# EAGLE design BMS Schematic (EAGLE 8.5.0)

## Sheet 1 of 3
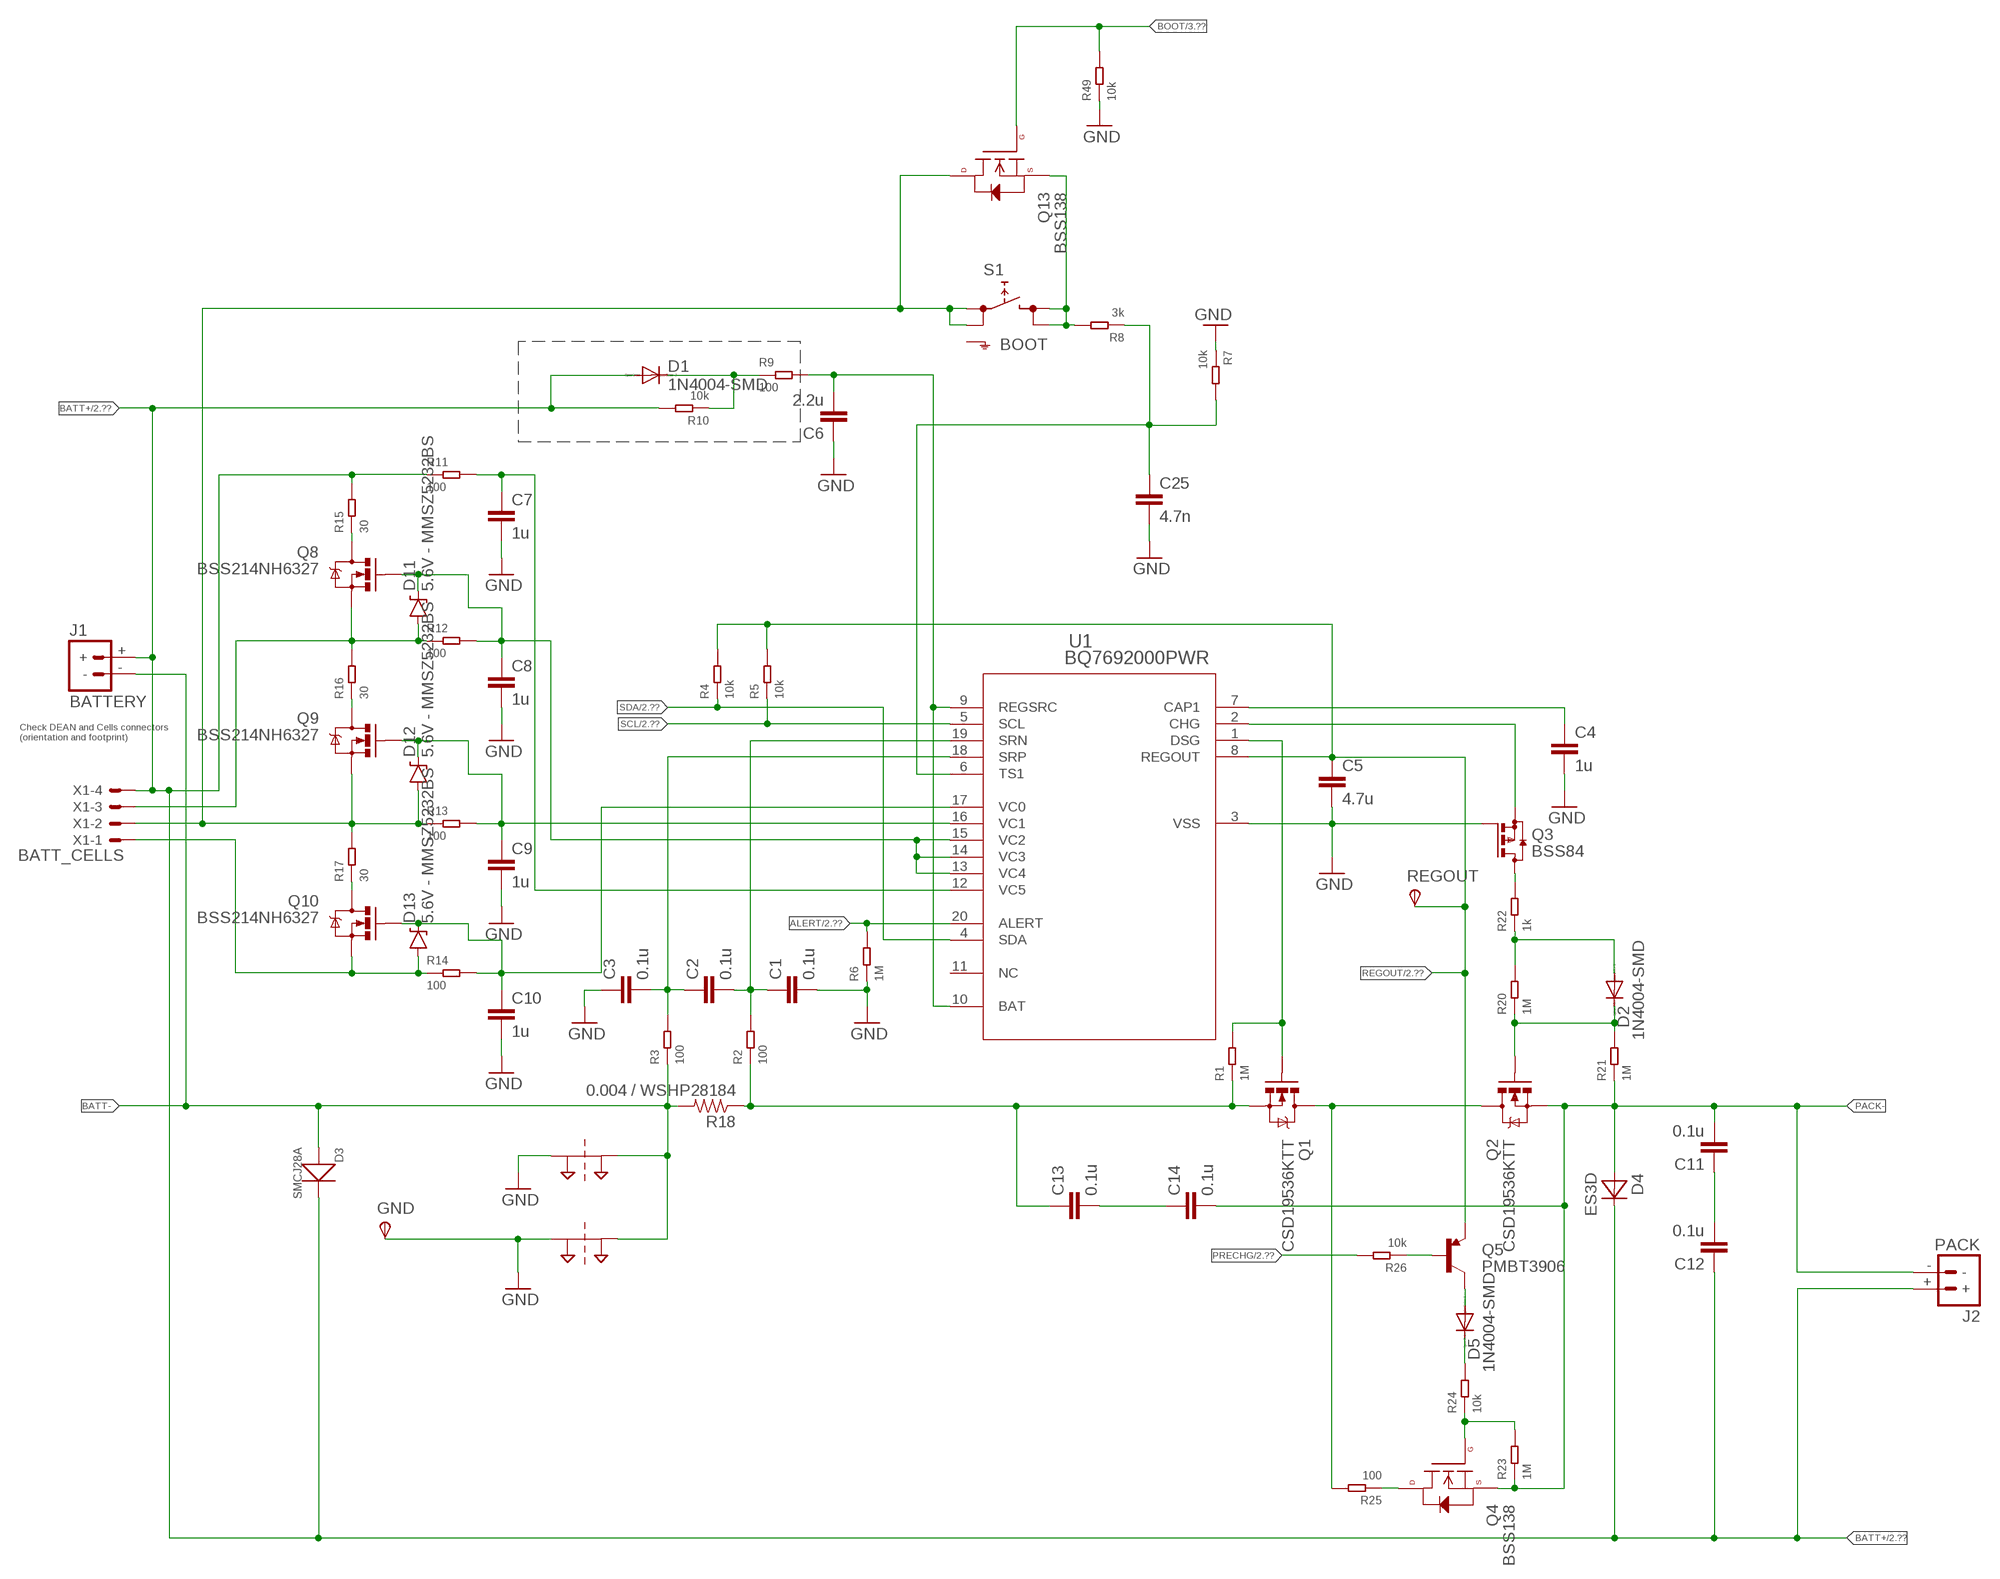
[diagram p0: schematic, sheet 1]

### Parts
C1  0.1u  CAP0805  [0805]
C2  0.1u  CAP0805  [0805]
C3  0.1u  CAP0805  [0805]
C4  1u  CAP0805  [0805]
C5  4.7u  CAP0805  [0805]
C6  2.2u  C-EUC1206  [C1206]
C7  1u  CAP0805  [0805]
C8  1u  CAP0805  [0805]
C9  1u  CAP0805  [0805]
C10  1u  CAP0805  [0805]
C11  0.1u  CAP0805  [0805]
C12  0.1u  CAP0805  [0805]
C13  0.1u  CAP0805  [0805]
C14  0.1u  CAP0805  [0805]
C25  4.7n  CAP0805  [0805]
D1  1N4004-SMD  [DO-214]
D2  1N4004-SMD  [DO-214]
D3  SMCJ28A  SMD-DIODE-SCHOTTKY-40V-3A(DO-214AB)  [DO-214AB]
D4  ES3D  [SMC]
D5  1N4004-SMD  [DO-214]
D11  5.6V - MMSZ5232BS  DIODE-ZENER5.6V  [SOD-323]
D12  5.6V - MMSZ5232BS  DIODE-ZENER5.6V  [SOD-323]
D13  5.6V - MMSZ5232BS  DIODE-ZENER5.6V  [SOD-323]
GND  GND  TPSPAD1-17  [P1-17]
J1  BATTERY  BATTERY_CONN_DEANS  [DEANS]
J2  PACK  BATTERY_CONN_DEANS  [DEANS]
PT1  2PT_GND_TIE  [2PT_GND_TIE]
PT2  2PT_GND_TIE  [2PT_GND_TIE]
Q1  CSD19536KTT  MOSFET-NCHANNELPSMN7R0  [TO-263/D2PAK]
Q2  CSD19536KTT  MOSFET-NCHANNELPSMN7R0  [TO-263/D2PAK]
Q3  BSS84  [SOT23]
Q4  BSS138  N-CHANNEL-MOSFET-BSS138  [SOT23-3]
Q5  PMBT3906  TRANSISTOR_PNPPMBT3906  [SOT23-3]
Q8  BSS214NH6327  MOSFET-NCHANNELBSS138  [SOT23-3]
Q9  BSS214NH6327  MOSFET-NCHANNELBSS138  [SOT23-3]
Q10  BSS214NH6327  MOSFET-NCHANNELBSS138  [SOT23-3]
Q13  BSS138  N-CHANNEL-MOSFET-BSS138  [SOT23-3]
R1  1M  RES-0805  [R0805]
R2  100  RES-0805  [R0805]
R3  100  RES-0805  [R0805]
R4  10k  RES-0805  [R0805]
R5  10k  RES-0805  [R0805]
R6  1M  RES-0805  [R0805]
R7  10k  RES-0805  [R0805]
R8  3k  RES-0805  [R0805]
R9  100  RES-0805  [R0805]
R10  10k  RES-0805  [R0805]
R11  100  RES-0805  [R0805]
R12  100  RES-0805  [R0805]
R13  100  RES-0805  [R0805]
R14  100  RES-0805  [R0805]
R15  30  RES-2512  [R2512]
R16  30  RES-2512  [R2512]
R17  30  RES-2512  [R2512]
R18  0.004 / WSHP28184  0.001OHM-3W-1%(2512)3W/1%  [2512]
R20  1M  RES-0805  [R0805]
R21  1M  RES-0805  [R0805]
R22  1k  RES-0805  [R0805]
R23  1M  RES-0805  [R0805]
R24  10k  RES-0805  [R0805]
R25  100  RES-2512  [R2512]
R26  10k  RES-0805  [R0805]
R49  10k  RES-0805  [R0805]
REGOUT  TPSB2,54  [B2,54]
S1  BOOT  SKHMPSE010  [SKHMPXE010]
U1  BQ7692000PWR  BQ7692006PWR  [PW20]
X1  BATT_CELLS  C-GRID-04-70543  [70543-04]

### Nets
ALERT: R6.2 U1.20(ALERT) ; also sheet 2
BATT+: C12.1 D1.A D3.2(-) D4.C J1.+ J2.+ R10.2 R11.1 R15.2 X1.4 ; also sheet 2,3
BATT-: D3.1(+) J1.- PT1.P$2 PT2.P$2 R3.1 R18.2
BOOT: Q13.1(G) R49.2 ; also sheet 3
CHG: Q3.2(S) U1.2(CHG)
DSG: Q1.1(G) R1.2 U1.1(DSG)
DSG-CHG: Q1.2(D) Q2.2(D) R25.2
GND: C1.2 C3.1 C4.2 C5.2 C6.1 C7.2 C8.2 C9.2 C10.2 C25.2 GND.TP(PP) PT1.P$1 PT2.P$1 Q3.1(G) R6.1 R7.1 R49.1 U1.3(VSS) ; also sheet 2,3
N$1: C2.1 C3.2 R3.2 U1.18(SRP)
N$2: C1.1 C2.2 R2.2 U1.19(SRN)
N$4: C6.2 R9.2 U1.9(REGSRC) U1.10(BAT)
N$5: C4.1 U1.7(CAP1)
N$9: C25.1 R7.2 R8.1 U1.6(TS1)
N$10: D1.C R9.1 R10.1
N$11: Q13.2(S) R8.2 S1.3(2.1) S1.4(2.2)
N$12: D13.A Q10.2(S) R14.1 X1.1
N$13: C7.1 R11.2 U1.12(VC5)
N$14: Q8.3(D) R15.1
N$16: C10.1 D13.C Q10.1(G) R14.2 U1.17(VC0)
N$18: D11.A Q8.2(S) R12.1 R16.2 X1.3
N$19: Q9.3(D) R16.1
N$20: D2.C Q2.1(G) R20.1 R21.2
N$21: C8.1 D11.C Q8.1(G) R12.2 U1.13(VC4) U1.14(VC3) U1.15(VC2)
N$22: Q10.3(D) R17.1
N$24: C11.1 C12.2
N$26: D2.A R20.2 R22.1
N$27: D12.A Q9.2(S) Q13.3(D) R13.1 R17.2 S1.1(1.1) S1.2(1.2) X1.2
N$28: Q3.3(D) R22.2
N$29: C13.2 C14.1
N$30: Q4.1(G) R23.2 R24.1
N$31: D5.C R24.2
N$32: D5.A Q5.3(C)
N$33: Q5.1(B) R26.1
N$34: Q4.3(D) R25.1
N$67: C9.1 D12.C Q9.1(G) R13.2 U1.16(VC1)
PACK-: C11.2 C14.2 D4.A J2.- Q2.3(S) Q4.2(S) R21.1 R23.1
PRECHG: R26.2 ; also sheet 2
REGOUT: C5.1 Q5.2(E) R4.2 R5.2 REGOUT.TP(PP) U1.8(REGOUT) ; also sheet 2,3
RSNS-DSG: C13.1 Q1.3(S) R1.1 R2.1 R18.1
SCL: R5.1 U1.5(SCL) ; also sheet 2
SDA: R4.1 U1.4(SDA) ; also sheet 2
Unconnected: S1.5(SH) U1.11(NC)

### Notes on the sheet
- Check DEAN and Cells connectors 
  (orientation and footprint)

## Sheet 2 of 3
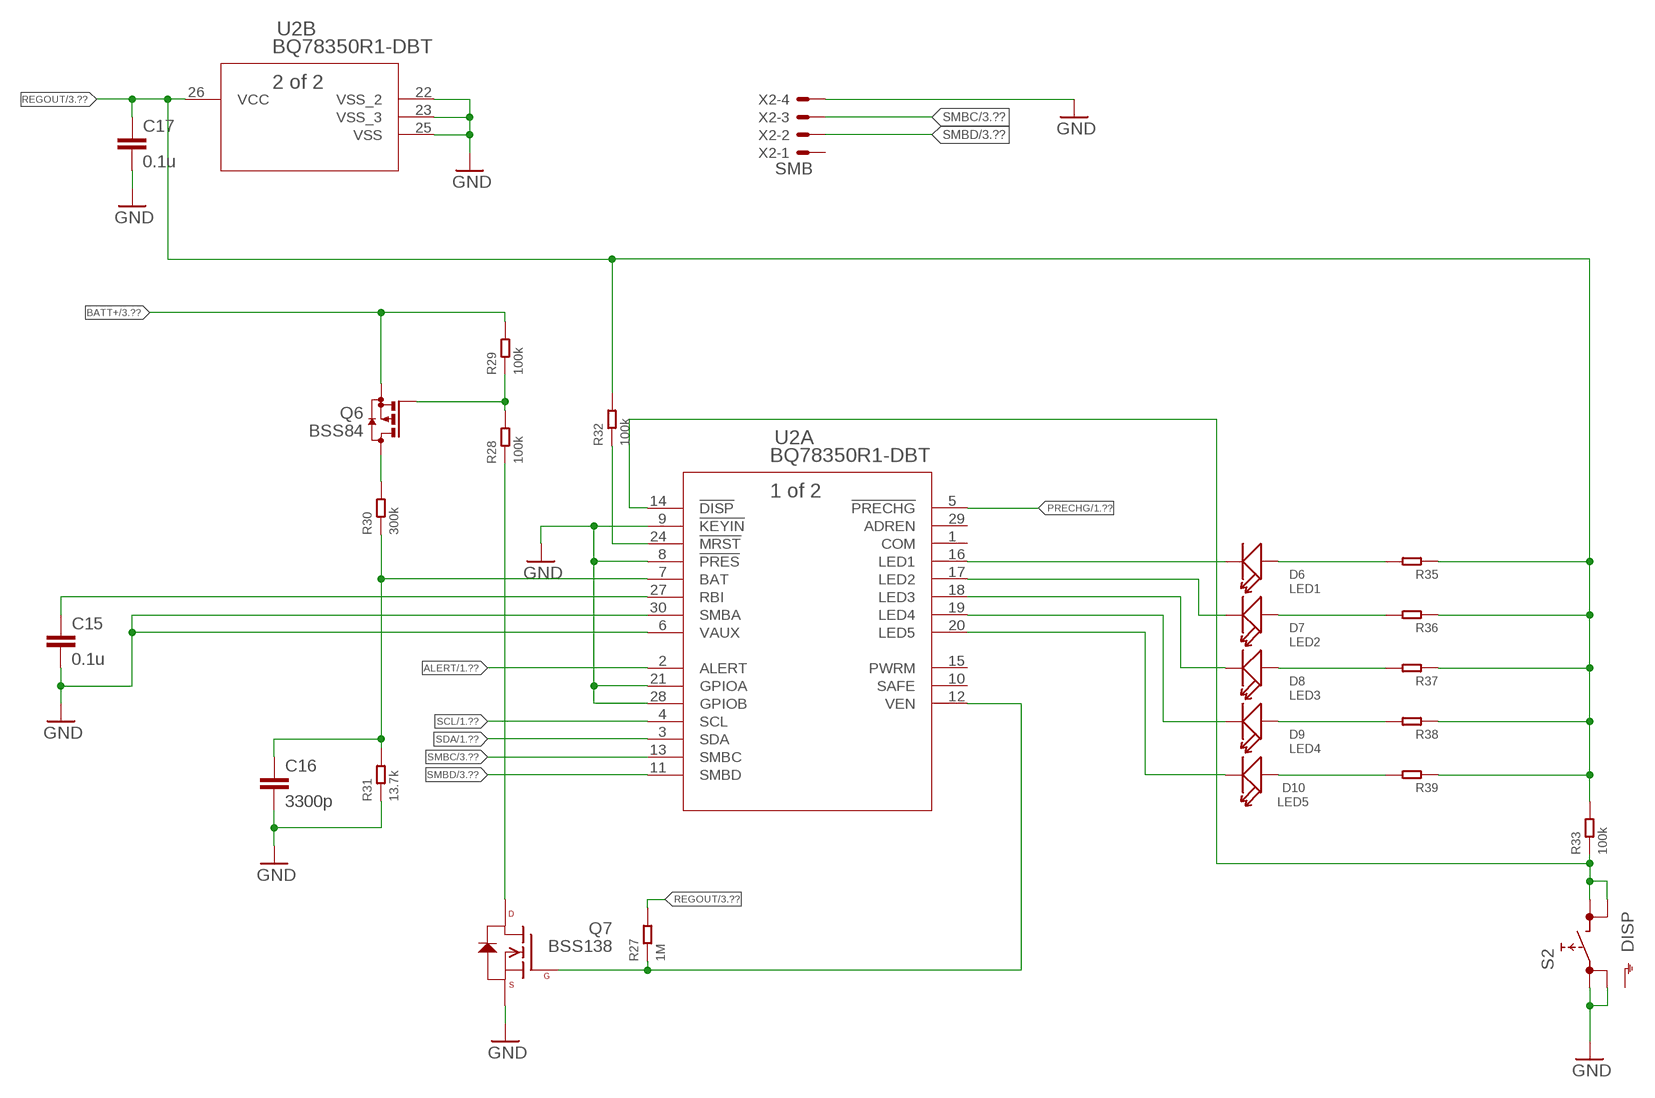
[diagram p1: schematic, sheet 2]

### Parts
C15  0.1u  CAP0805  [0805]
C16  3300p  CAP0805  [0805]
C17  0.1u  CAP0805  [0805]
D6  LED1  SMD-LED-CLEAR-GREEN(0805)  [LED-0805]
D7  LED2  SMD-LED-CLEAR-GREEN(0805)  [LED-0805]
D8  LED3  SMD-LED-CLEAR-GREEN(0805)  [LED-0805]
D9  LED4  SMD-LED-CLEAR-GREEN(0805)  [LED-0805]
D10  LED5  SMD-LED-CLEAR-RED(0805)  [LED-0805]
Q6  BSS84  [SOT23]
Q7  BSS138  N-CHANNEL-MOSFET-BSS138  [SOT23-3]
R27  1M  RES-0805  [R0805]
R28  100k  RES-0805  [R0805]
R29  100k  RES-0805  [R0805]
R30  300k  RES-0805  [R0805]
R31  13.7k  RES-0805  [R0805]
R32  100k  RES-0805  [R0805]
R33  100k  RES-0805  [R0805]
R35  RES-0805  [R0805]
R36  RES-0805  [R0805]
R37  RES-0805  [R0805]
R38  RES-0805  [R0805]
R39  RES-0805  [R0805]
S2  DISP  SKHMPSE010  [SKHMPXE010]
U2  BQ78350R1-DBT  [DBT30]
X2  SMB  C-GRID-04-70543  [70543-04]

### Nets
ALERT: U2.2(A:ALERT) ; also sheet 1
BATT+: Q6.2(S) R29.2 ; also sheet 1,3
GND: C15.2 C16.2 C17.2 Q7.2(S) R31.1 S2.1(1.1) S2.2(1.2) U2.6(A:VAUX) U2.8(A:!PRES) U2.9(A:!KEYIN) U2.21(A:GPIOA) U2.22(B:VSS_2) U2.23(B:VSS_3) U2.25(B:VSS) U2.28(A:GPIOB) U2.30(A:SMBA) X2.4 ; also sheet 1,3
N$23: C15.1 U2.27(A:RBI)
N$35: Q7.1(G) R27.1 U2.12(A:VEN)
N$36: Q7.3(D) R28.1
N$37: Q6.1(G) R28.2 R29.1
N$38: Q6.3(D) R30.2
N$39: C16.1 R30.1 R31.2 U2.7(A:BAT)
N$40: R32.1 U2.24(A:!MRST)
N$41: D6.- U2.16(A:LED1)
N$42: D7.- U2.17(A:LED2)
N$43: D8.- U2.18(A:LED3)
N$44: D9.- U2.19(A:LED4)
N$45: D10.- U2.20(A:LED5)
N$46: D6.+ R35.2
N$47: D7.+ R36.2
N$48: R33.1 S2.3(2.1) S2.4(2.2) U2.14(A:!DISP)
N$49: D8.+ R37.2
N$50: D9.+ R38.2
N$51: D10.+ R39.2
PRECHG: U2.5(A:!PRECHG) ; also sheet 1
REGOUT: C17.1 R27.2 R32.2 R33.2 R35.1 R36.1 R37.1 R38.1 R39.1 U2.26(B:VCC) ; also sheet 1,3
SCL: U2.4(A:SCL) ; also sheet 1
SDA: U2.3(A:SDA) ; also sheet 1
SMBC: U2.13(A:SMBC) X2.3 ; also sheet 3
SMBD: U2.11(A:SMBD) X2.2 ; also sheet 3
Unconnected: S2.5(SH) U2.1(A:COM) U2.10(A:SAFE) U2.15(A:PWRM) U2.29(A:ADREN) X2.1

## Sheet 3 of 3
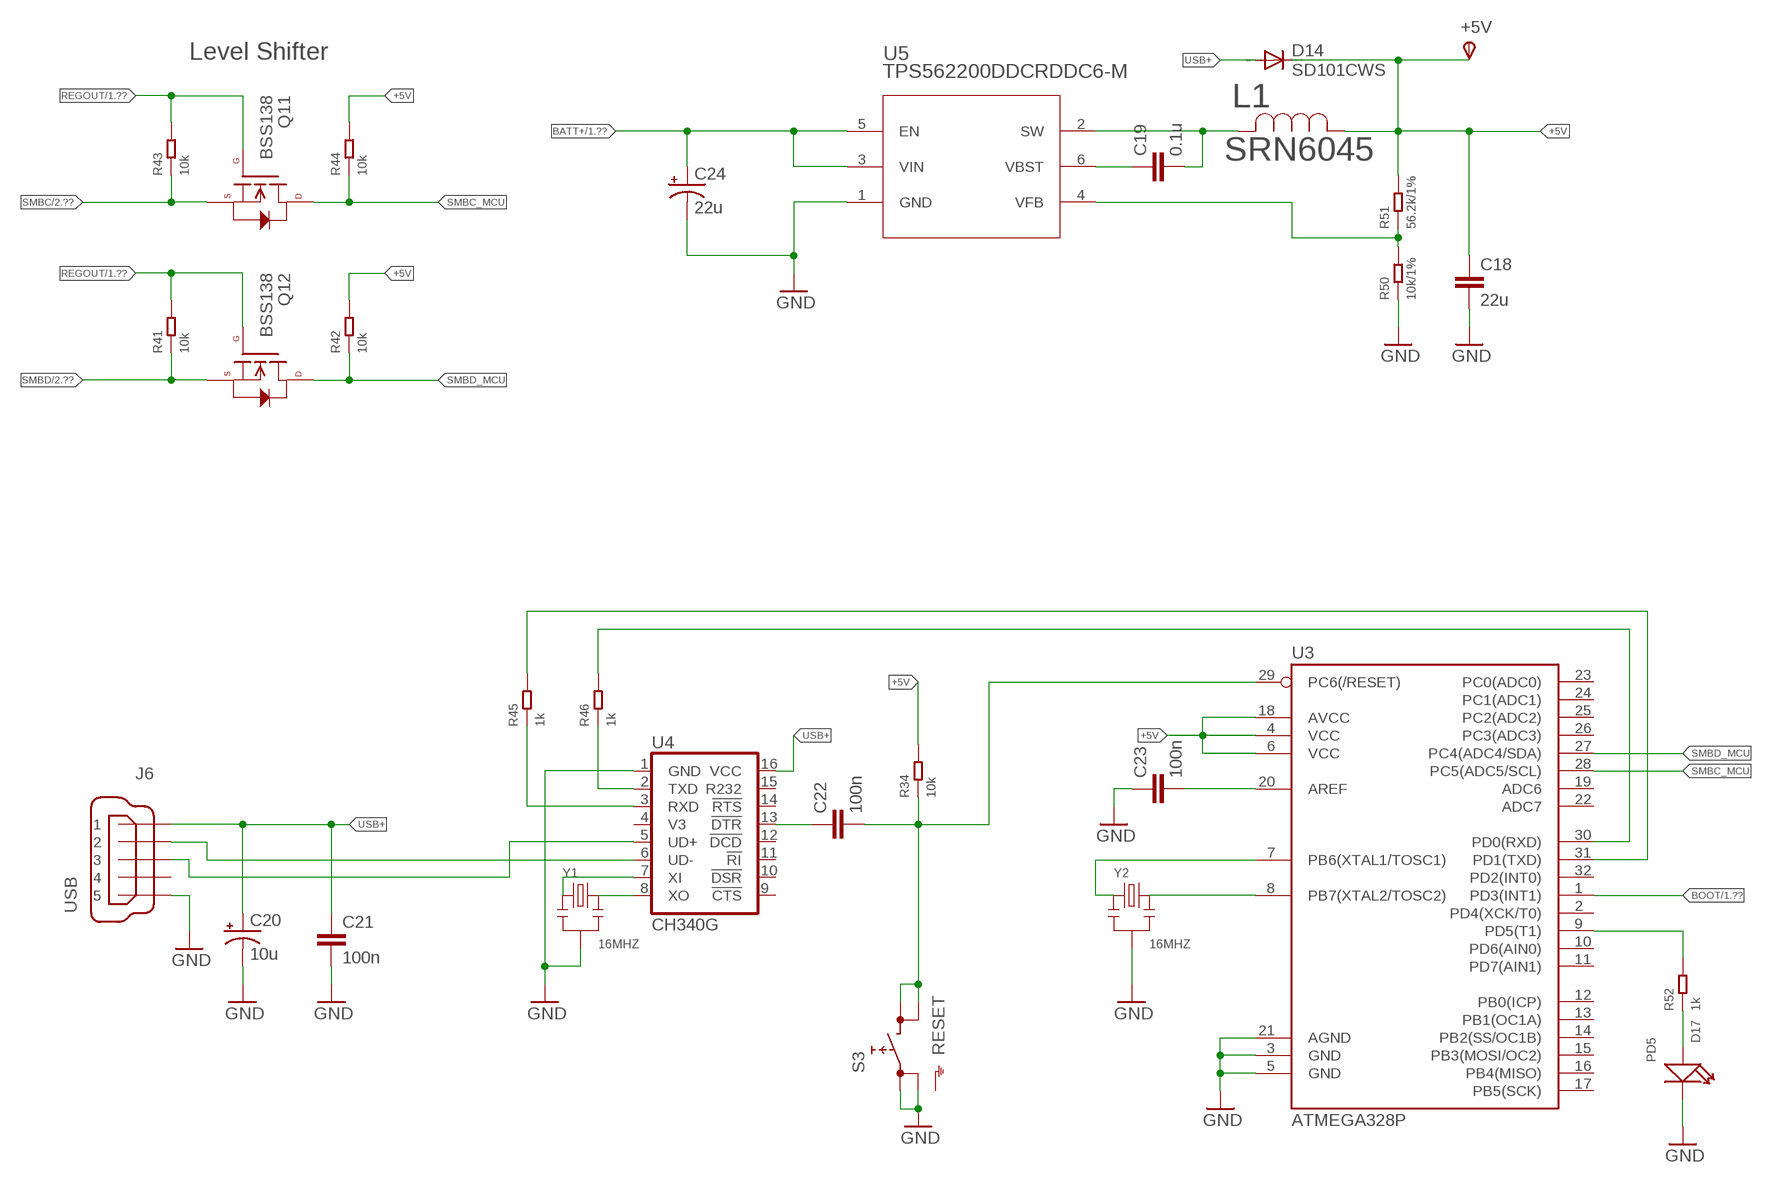
[diagram p2: schematic, sheet 3]

### Parts
+5V  TPSB2,54  [B2,54]
C18  22u  CAP0805  [0805]
C19  0.1u  CAP0805  [0805]
C20  10u  CAP_POL1206-KIT  [EIA3216-KIT]
C21  100n  CAP0603-CAP  [0603-CAP]
C22  100n  CAP0603-CAP  [0603-CAP]
C23  100n  CAP0603-CAP  [0603-CAP]
C24  22u  CAP_POLC  [PANASONIC_C]
D14  SD101CWS  DIODE-SOD323-W  [SOD323-W]
D17  PD5  SMD-LED-CLEAR-GREEN(0805)  [LED-0805]
J6  USB  MINI-USB-ARDUINO-NANO  [USB-MINI-B_2]
L1  SRN6045  BOURNS_SRN6045  [IND_BOURNS_SRN6045]
Q11  BSS138  N-CHANNEL-MOSFET-BSS138  [SOT23-3]
Q12  BSS138  N-CHANNEL-MOSFET-BSS138  [SOT23-3]
R34  10k  RES-0805  [R0805]
R41  10k  RES-0805  [R0805]
R42  10k  RES-0805  [R0805]
R43  10k  RES-0805  [R0805]
R44  10k  RES-0805  [R0805]
R45  1k  RES-0805  [R0805]
R46  1k  RES-0805  [R0805]
R50  10k/1%  RES-0805  [R0805]
R51  56.2k/1%  RES-0805  [R0805]
R52  1k  RES-0805  [R0805]
S3  RESET  SKHMPSE010  [SKHMPXE010]
U3  ATMEGA328P  ATMEGA328P_TQFP  [TQFP32-08]
U4  CH340G  CH340GSMD  [SO016]
U5  TPS562200DDCRDDC6-M  [DDC6-M]
Y1  16MHZ  SMD-RESONATOR-16MHZ-15PF-0.5%-40R(3P-3.2X1.3MM)  [X3-SMD-3.6X1.3X0.8MM]
Y2  16MHZ  SMD-RESONATOR-16MHZ-15PF-0.5%-40R(3P-3.2X1.3MM)  [X3-SMD-3.6X1.3X0.8MM]

### Nets
+5V: +5V.TP(PP) C18.1 D14.C L1.1 R34.2 R42.2 R44.2 R51.2 U3.4(VCC) U3.6(VCC) U3.18(AVCC)
BATT+: C24.+ U5.3(VIN) U5.5(EN) ; also sheet 1,2
BOOT: U3.1(PD3(INT1)) ; also sheet 1
GND: C18.2 C20.C(-) C21.2 C23.1 C24.- D17.- J6.1 R50.1 S3.1(1.1) S3.2(1.2) U3.3(GND) U3.5(GND) U3.21(AGND) U4.1(GND) U5.1(GND) Y1.2 Y2.2 ; also sheet 1,2
N$6: J6.4 U4.6(UD-)
N$7: J6.3 U4.5(UD+)
N$55: C22.1 U4.13(!DTR)
N$56: C22.2 R34.1 S3.3(2.1) S3.4(2.2) U3.29(PC6(/RESET))
N$58: U4.7(XI) Y1.1
N$59: U4.8(XO) Y1.3
N$60: R45.1 U4.3(RXD)
N$61: U3.8(PB7(XTAL2/TOSC2)) Y2.3
N$62: U3.7(PB6(XTAL1/TOSC1)) Y2.1
N$63: R46.1 U4.2(TXD)
N$64: R45.2 U3.31(PD1(TXD))
N$65: R46.2 U3.30(PD0(RXD))
N$66: C23.2 U3.20(AREF)
N$68: R50.2 R51.1 U5.4(VFB)
N$70: C19.1 U5.6(VBST)
N$71: R52.2 U3.9(PD5(T1))
N$72: D17.+ R52.1
REGOUT: Q11.1(G) Q12.1(G) R41.2 R43.2 ; also sheet 1,2
SMBC: Q11.2(S) R43.1 ; also sheet 2
SMBC_MCU: Q11.3(D) R44.1 U3.28(PC5(ADC5/SCL))
SMBD: Q12.2(S) R41.1 ; also sheet 2
SMBD_MCU: Q12.3(D) R42.1 U3.27(PC4(ADC4/SDA))
SW: C19.2 L1.2 U5.2(SW)
USB+: C20.A(+) C21.1 D14.A J6.5 U4.16(VCC)
Unconnected: J6.2 S3.5(SH) U3.2(PD4(XCK/T0)) U3.10(PD6(AIN0)) U3.11(PD7(AIN1)) U3.12(PB0(ICP)) U3.13(PB1(OC1A)) U3.14(PB2(SS/OC1B)) U3.15(PB3(MOSI/OC2)) U3.16(PB4(MISO)) U3.17(PB5(SCK)) U3.19(ADC6) U3.22(ADC7) U3.23(PC0(ADC0)) U3.24(PC1(ADC1)) U3.25(PC2(ADC2)) U3.26(PC3(ADC3)) U3.32(PD2(INT0)) U4.4(V3) U4.9(!CTS) U4.10(!DSR) U4.11(!RI) U4.12(!DCD) U4.14(!RTS) U4.15(R232)

### Notes on the sheet
- Level Shifter

## Library data of the parts
+5V REGOUT = testpad:TPS: TEST PIN
C1-C5 C7-C19 C21-C23 C25 = SparkFun-Passives:CAP: Capacitor Standard 0603 ceramic capacitor, and 0.1" leaded capacitor.
C6 = resistor:C-EU: CAPACITOR, European symbol
C20 C24 = SparkFun-Capacitors:CAP_POL: Capacitor Polarized These are standard SMD and PTH capacitors. Normally 10uF, 47uF, and 100uF in electrolytic and tantalum varieties. Always verify the external diameter of the through hole cap, it varies with capacity, voltage, and manufacturer. The EIA devices should be standard.
D1 D2 D5 = 0_Club_robot:1N4004: DIODE general purpose rectifier, 1 A
D3 = Seeed-OPL-Diode:SMD-DIODE-SCHOTTKY-40V-3A(DO-214AB): 304020018; MPN: SS34-E3/57T; VALUE: 40V-3A
D4 = 0_Club_robot:ES3D: Rectifier diode 3A 200V
D6-D9 D17 = Seeed-OPL-Diode:SMD-LED-CLEAR-GREEN(0805): 304090057; MPN: 17-215SYGC/S530-E2/TR8; VALUE: GREEN-0805
D10 = Seeed-OPL-Diode:SMD-LED-CLEAR-RED(0805): 304090046; MPN: 17-215SURC/S530-A2/TR8; VALUE: RED-0805
D11-D13 = SparkFun-DiscreteSemi:DIODE-ZENER: Zener Diode Production Part - 8199 3.4V Zener Voltage; PROD_ID: DIO-12442; VALUE: 5.6V
D14 = diode:DIODE-: DIODE
GND = testpad:TPS: TEST PIN; SPICEPREFIX: X
J1 J2 = SparkFun-Connectors-Save:BATTERY_CONN: Battery Connectors Various footprints for battery connections SparkFun Products: Deans Connector -M/F Pair <https://www.sparkfun.com/products/11864>; SF_ID: PRT-11864
J6 = MyCON2:MINI-USB-ARDUINO-NANO
L1 = inductanceBuck:BOURNS_SRN6045
PT1 PT2 = SparkFun-Passives:2PT_GND_TIE: Package for connecting two ground nets in one place.
Q1 Q2 = SparkFun-DiscreteSemi:MOSFET-NCHANNEL: Common NMOSFET Parts MFG P/N Store ID Prod ID FDD8780 TRANS-09984 SI7820DN TRANS-11055 FDS6630A IC-08089 2N7002PW TRANS-11151 FQP30N06L COM-10213 TRANS-10060 BSS123LT1G TRANS-08345 BSS138 TRANS-00830 BS170 2N7000; PROD_ID: TRANS-12437; VALUE: 100A/100V
Q3 Q6 = transistor-small-signal:BSS84: P-CHANNEL MOS FET
Q4 Q7 Q11-Q13 = GeekAmmo:N-CHANNEL-MOSFET: N-Channel MOSFET Mode Field Effect Transistor; DATASHEET: http://www.fairchildsemi.com/ds/BS/BSS138.pdf; DIGIKEY: BSS138TR-ND; ELEMENT14: 2323154; URL: http://au.element14.com/fairchild-semiconductor/bss138/mosfet-n-ch-50v-220ma-sot-23/dp/2323154
Q5 = SparkFun-DiscreteSemi:TRANSISTOR_PNP: Generic PNP BJT Double check pinouts against datasheets- not all devices are the same! MMBT3906 - 40V 200mA SOT-23 (TRANS-08052) MMBT4403 - 40V 600mA SOT-23 (TRANS-09245); PROD_ID: TRANS-08052
Q8-Q10 = SparkFun-DiscreteSemi:MOSFET-NCHANNEL: Common NMOSFET Parts MFG P/N Store ID Prod ID FDD8780 TRANS-09984 SI7820DN TRANS-11055 FDS6630A IC-08089 2N7002PW TRANS-11151 FQP30N06L COM-10213 TRANS-10060 BSS123LT1G TRANS-08345 BSS138 TRANS-00830 BS170 2N7000; PROD_ID: TRANS-00830; VALUE: 200mA/50V
R1-R17 R20-R39 R41-R46 R49-R52 = Seeed-OPL-Resistor:RES
R18 = SparkFun-Resistors:0.001OHM-3W-1%(2512); PROD_ID: RES-12449; VALUE: 0.001
S1-S3 = switch:SKHMP*E010: 6.2 X 6.5mm TACT Switch (SMD) Source: http://www3.alps.co.jp/WebObjects/catalog.woa/PDF/E/Switch/Tact/SKHM/SKHM.PDF
U1 = BQ76920:BQ7692006PWR; MANUFACTURER_PART_NUMBER: BQ7692006PWR; VENDOR: Texas Instruments
U2 = bq78350:BQ78350R1-DBT; MANUFACTURER_PART_NUMBER: BQ78350DBT; VENDOR: Texas Instruments
U3 = SparkFun-DigitalIC:ATMEGA328P_TQFP; PROD_ID: IC-09069; VALUE: ATMEGA328P_TQFP
U4 = Serial-Basic:CH340G: A simple USB 2.0 to Serial IC.; PROD_ID: IC-13498
U5 = TPS562200:TPS562200DDCR; MANUFACTURER_PART_NUMBER: TPS562200DDCR; VENDOR: Texas Instruments
X1 X2 = con-molex:C-GRID-04: CONNECTOR wire to board 2.54 mm (0.100") pitch header; OC_FARNELL: unknown; OC_NEWARK: unknown
Y1 Y2 = Seeed-OPL-Crystal-Oscillator:SMD-RESONATOR-16MHZ-15PF-0.5%-40R(3P-3.2X1.3MM): 306030002; MPN: CSTCE16M0V53-R0

## Board
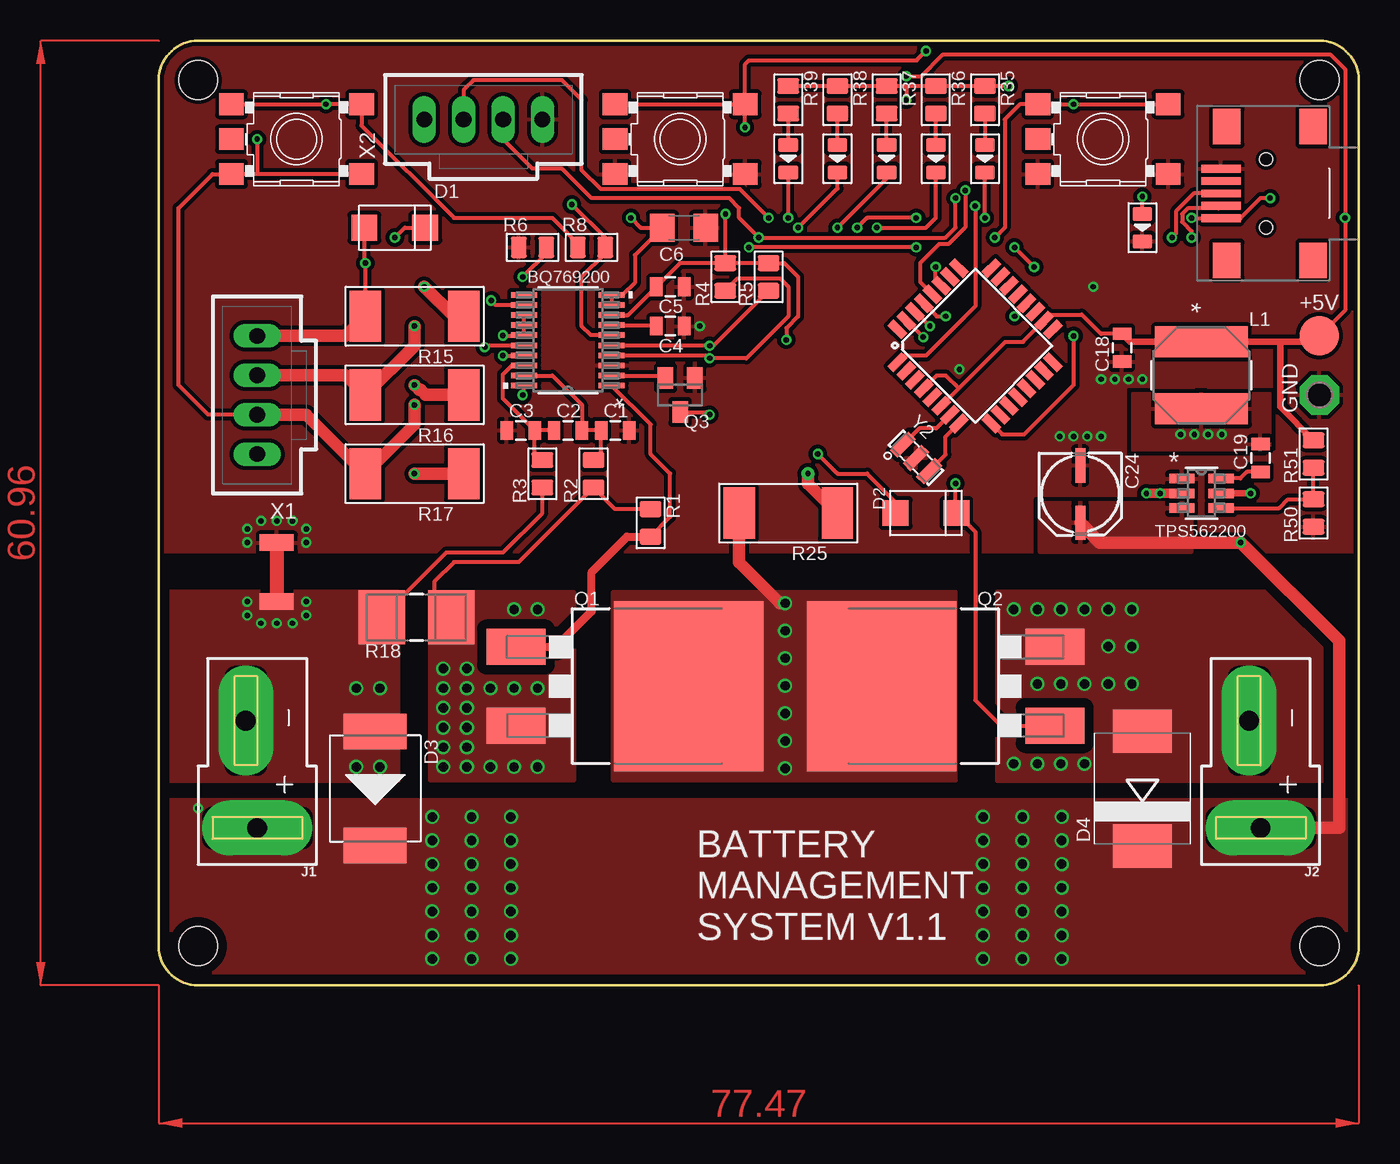
[diagram p3: board, top side]
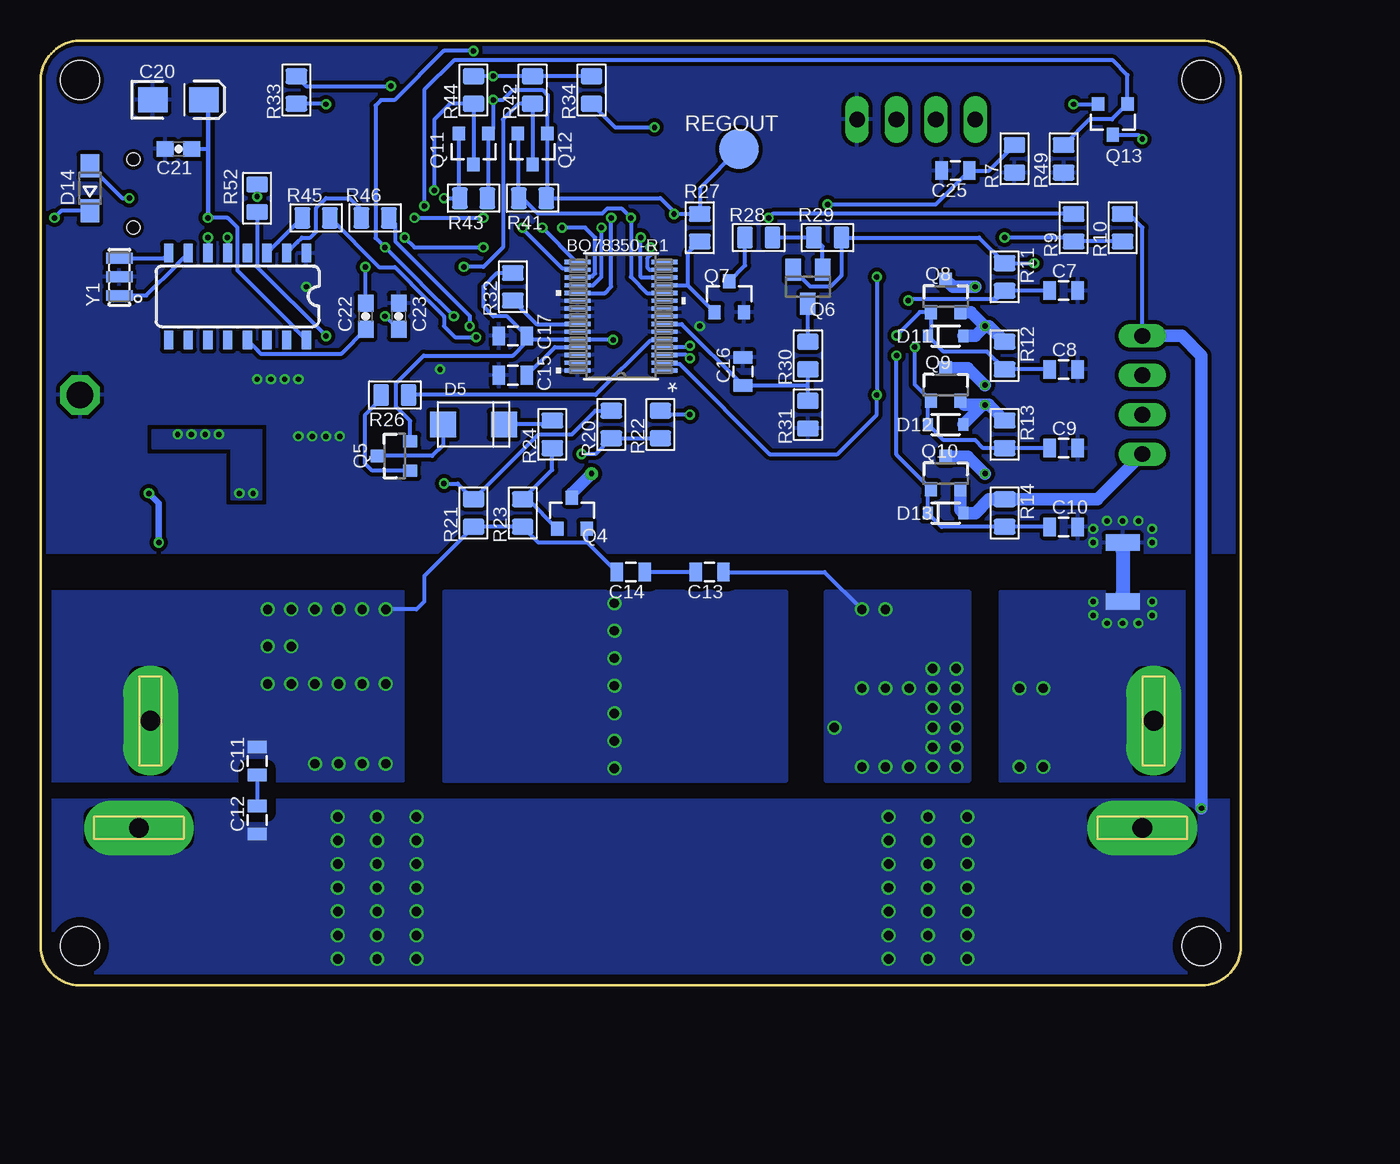
[diagram p4: board, bottom side, seen from below]

Size 77.47 x 60.96 mm. Coordinates in mm from the lower left corner, seen from the top.
Outline: 2.54,0 arc-90 0,2.54 0,58.42 arc-90 2.54,60.96 74.93,60.96 arc-90 77.47,58.42 77.47,2.54 arc-90 74.93,0 2.54,0
Copper layers (1*16): Top 0.035mm / dielectric 1.5mm / Bottom 0.035mm
Design rules "SeeedStudio_2layer_DRU_no_angle_20140221": minimum track width 6mil, minimum drill 12mil, track to track 6mil, track to pad 6mil, pad to pad 6mil, via to via 6mil, smd to smd 0mil, copper to edge 10mil, drill to drill 10mil, minimum pad ring 10mil, minimum via ring 6mil, stop-mask expansion 2mil, vias tented up to drill 100mil, thermal gap 10mil
Holes 2.5 mm at 2.54,2.54 2.54,58.42 74.93,2.54 74.93,58.42

### Footprints (pad centres in the part's own frame; a part is rotated, then mirrored left to right if it is on the bottom)
B2,54 = smd 2.54 x 2.54: TP 0,0
0805 = smd 0.8 x 1.2: 1 -0.9,0; 2 0.9,0
C1206 = smd 1.6 x 1.8: 1 -1.4,0; 2 1.4,0
EIA3216-KIT = smd 1.9 x 1.6: A 1.65,0; C -1.65,0
0603-CAP = smd 1.1 x 1: 1 -0.85,0; 2 0.85,0
PANASONIC_C = smd 2.2 x 0.65: + 1.9,-0.2; - -1.8,-0.2
DO-214 = smd 1.67 x 1.67: A -1.965,0; C 1.965,0
DO-214AB = smd 2.286 x 4.064: 1 -3.683,0; 2 3.683,0
SMC = smd 2.8 x 3.8: A 3.7,0; C -3.7,0
LED-0805 = smd 0.889 x 1.27: + -0.889,0; - 0.889,0
SOD-323 = smd 0.63 x 0.83: A 1.15,0; C -1.15,0
SOD323-W = smd 1.5 x 1.2: A 1.45,0; C -1.45,0
P1-17 = drill 1.702 pad 2.54 octagon: TP 0,0
DEANS = drill 1.27 pad 3.556 long: + 0,0; - 0.737,-6.921
USB-MINI-B_2 = smd 0.508 x 2.54: 1 0,0; 2 0.8,0; 3 1.6,0; 4 2.4,0; 5 3.2,0 | smd 2.286 x 1.778: 6 -2.717,5.948; 7 -2.717,0.36; 8 5.918,0.36; 9 5.918,5.948 | hole 0.813: -0.6,2.9; 3.8,2.9
IND_BOURNS_SRN6045 = smd 2.007 x 5.994: 1 -2.159,0; 2 2.159,0
2PT_GND_TIE = smd 2.184 x 1.067: P$1 0,1.905; P$2 0,-1.905
TO-263/D2PAK = smd 2.32 x 3.81: 1 -2.54,-7.045; 3 2.54,-7.045 | smd 11 x 9.65: 2 0,4.125
SOT23 = smd 1 x 1.4: 1 -0.95,-1.1; 2 0.95,-1.1; 3 0,1.1
SOT23-3 = smd 0.8 x 0.9: 1 -0.95,-1; 2 0.95,-1; 3 0,1
SOT23-3' = smd 0.8 x 0.9: 1 -0.95,-1; 2 0.95,-1; 3 0,1.1
R0805 = smd 1.397 x 1.016: 1 0,0.889; 2 0,-0.889
R2512 = smd 2.032 x 3.302: 1 -3.175,0; 2 3.175,0
2512 = smd 3 x 3.5: 1 -2.25,0; 2 2.25,0
SKHMPXE010 = smd 1.6 x 1.4: 1 -4.2,2.25; 2 4.2,2.25; 3 -4.2,-2.25; 4 4.2,-2.25; 5 4.2,0
PW20 = smd 1.676 x 0.356: 1 -2.819,2.925; 2 -2.819,2.275; 3 -2.819,1.625; 4 -2.819,0.975; 5 -2.819,0.325; 6 -2.819,-0.325; 7 -2.819,-0.975; 8 -2.819,-1.625; 9 -2.819,-2.275; 10 -2.819,-2.925; 11 2.819,-2.925; 12 2.819,-2.275; 13 2.819,-1.625; 14 2.819,-0.975; 15 2.819,-0.325; 16 2.819,0.325; 17 2.819,0.975; 18 2.819,1.625; 19 2.819,2.275; 20 2.819,2.925
DBT30 = smd 1.676 x 0.279: 1 -2.819,3.5; 2 -2.819,3; 3 -2.819,2.5; 4 -2.819,2; 5 -2.819,1.5; 6 -2.819,1; 7 -2.819,0.5; 8 -2.819,0; 9 -2.819,-0.5; 10 -2.819,-1; 11 -2.819,-1.5; 12 -2.819,-2; 13 -2.819,-2.5; 14 -2.819,-3; 15 -2.819,-3.5; 16 2.819,-3.5; 17 2.819,-3; 18 2.819,-2.5; 19 2.819,-2; 20 2.819,-1.5; 21 2.819,-1; 22 2.819,-0.5; 23 2.819,0; 24 2.819,0.5; 25 2.819,1; 26 2.819,1.5; 27 2.819,2; 28 2.819,2.5; 29 2.819,3; 30 2.819,3.5
TQFP32-08 = smd 1.27 x 0.559: 1 -4.293,2.8; 2 -4.293,2; 3 -4.293,1.2; 4 -4.293,0.4; 5 -4.293,-0.4; 6 -4.293,-1.2; 7 -4.293,-2; 8 -4.293,-2.8; 17 4.293,-2.8; 18 4.293,-2; 19 4.293,-1.2; 20 4.293,-0.4; 21 4.293,0.4; 22 4.293,1.2; 23 4.293,2; 24 4.293,2.8 | smd 0.559 x 1.27: 9 -2.8,-4.293; 10 -2,-4.293; 11 -1.2,-4.293; 12 -0.4,-4.293; 13 0.4,-4.293; 14 1.2,-4.293; 15 2,-4.293; 16 2.8,-4.293; 25 2.8,4.293; 26 2,4.293; 27 1.2,4.293; 28 0.4,4.293; 29 -0.4,4.293; 30 -1.2,4.293; 31 -2,4.293; 32 -2.8,4.293
SO016 = smd 0.6 x 1.2: 1 -4.445,-2.8; 2 -3.175,-2.8; 3 -1.905,-2.8; 4 -0.635,-2.8; 5 0.635,-2.8; 6 1.905,-2.8; 7 3.175,-2.8; 8 4.445,-2.8; 9 4.445,2.8; 10 3.175,2.8; 11 1.905,2.8; 12 0.635,2.8; 13 -0.635,2.8; 14 -1.905,2.8; 15 -3.175,2.8; 16 -4.445,2.8
DDC6-M = smd 1.626 x 0.61: 1 -1.27,0.95; 2 -1.27,0; 3 -1.27,-0.95; 4 1.27,-0.95; 5 1.27,0; 6 1.27,0.95
70543-04 = drill 1.016 long: 1 -3.81,0; 2 -1.27,0; 3 1.27,0; 4 3.81,0
X3-SMD-3.6X1.3X0.8MM = smd 0.7 x 1.7: 1 -1.2,0; 2 0,0; 3 1.2,0

### Placement (x,y rotation side)
+5V  74.93,41.91 0 top
C1  29.46,35.81 0 top
C2  26.42,35.81 0 top
C3  23.37,35.81 0 top
C4  33.02,42.55 0 top
C5  33.02,45.09 0 top
C6  33.91,48.9 180 top
C7  11.43,44.83 0 bottom
C8  11.43,39.75 0 bottom
C9  11.43,34.67 0 bottom
C10  11.43,29.59 0 bottom
C11  63.5,14.48 90 bottom
C12  63.5,10.67 90 bottom
C13  34.29,26.67 180 bottom
C14  39.37,26.67 180 bottom
C15  46.99,39.37 180 bottom
C16  32.13,39.62 90 bottom
C17  46.99,41.91 180 bottom
C18  62.18,41.15 270 top
C19  71.12,34.04 90 top
C20  68.58,57.15 0 bottom
C21  68.58,53.98 180 bottom
C22  56.49,43.18 90 bottom
C23  54.36,43.18 270 bottom
C24  59.69,31.75 270 top
C25  18.41,52.58 180 bottom
D1  15.24,48.9 0 top
D2  49.53,30.48 0 top
D3  13.97,12.7 270 top
D4  63.5,12.7 90 top
D5  49.53,36.2 0 bottom
D6  53.34,53.34 270 top
D7  50.16,53.34 270 top
D8  46.99,53.34 270 top
D9  43.81,53.34 270 top
D10  40.64,53.34 270 top
D11  19.05,41.91 0 bottom
D12  19.05,36.2 0 bottom
D13  19.05,30.48 0 bottom
D14  74.3,51.44 90 bottom
D17  63.5,48.9 270 top
GND  74.93,38.1 90 top
J1  6.35,10.16 180 top
J2  71.12,10.16 180 top
J6  68.58,52.7 270 top
L1  67.31,39.37 270 top
PT1  7.62,26.67 0 top
PT2  7.62,26.67 0 bottom
Q1  30.1,19.3 270 top
Q2  50.8,19.3 90 top
Q3  33.66,38.1 180 top
Q4  43.18,30.48 0 bottom
Q5  PMBT3906  [SOT23-3']  54.61,34.16 90 bottom
Q6  27.94,45.09 180 bottom
Q7  33.02,44.45 0 bottom
Q8  BSS214NH6327  [SOT23-3']  19.05,44.45 0 bottom
Q9  BSS214NH6327  [SOT23-3']  19.05,38.73 0 bottom
Q10  BSS214NH6327  [SOT23-3']  19.05,33.02 0 bottom
Q11  49.53,53.98 180 bottom
Q12  45.72,53.98 180 bottom
Q13  8.26,55.88 180 bottom
R1  31.75,29.84 0 top
R2  28.07,33.02 180 top
R3  24.77,33.02 180 top
R4  36.58,45.72 180 top
R5  39.37,45.72 180 top
R6  24.13,47.62 90 top
R7  14.61,53.34 180 bottom
R8  27.94,47.62 270 top
R9  10.79,48.9 180 bottom
R10  7.62,48.9 180 bottom
R11  15.24,45.72 0 bottom
R12  15.24,40.64 0 bottom
R13  15.24,35.56 0 bottom
R14  15.24,30.48 0 bottom
R15  16.51,43.18 180 top
R16  16.51,38.1 180 top
R17  16.51,33.02 180 top
R18  16.64,23.75 180 top
R20  40.64,36.2 0 bottom
R21  49.53,30.48 180 bottom
R22  37.47,36.2 180 bottom
R23  46.35,30.48 180 bottom
R24  44.45,35.56 180 bottom
R25  40.64,30.48 180 top
R26  54.61,38.1 90 bottom
R27  34.92,48.9 180 bottom
R28  31.11,48.26 90 bottom
R29  26.67,48.26 90 bottom
R30  27.94,40.64 180 bottom
R31  27.94,36.83 180 bottom
R32  46.99,45.09 180 bottom
R33  60.96,57.78 180 bottom
R34  41.91,57.78 180 bottom
R35  53.34,57.15 0 top
R36  50.16,57.15 0 top
R37  46.99,57.15 0 top
R38  43.81,57.15 0 top
R39  40.64,57.15 0 top
R41  45.72,50.8 90 bottom
R42  45.72,57.78 180 bottom
R43  49.53,50.8 90 bottom
R44  49.53,57.78 180 bottom
R45  59.69,49.53 90 bottom
R46  55.88,49.53 90 bottom
R49  11.43,53.34 180 bottom
R50  74.55,30.48 180 top
R51  74.55,34.29 180 top
R52  63.5,50.8 0 bottom
REGOUT  32.38,53.98 0 bottom
S1  8.89,54.61 180 top
S2  60.96,54.61 180 top
S3  33.66,54.61 180 top
U1  26.42,41.63 180 top
U2  40.01,43.18 180 bottom
U3  52.7,41.27 45 top
U4  64.77,44.45 180 bottom
U5  67.31,31.75 0 top
X1  6.35,38.1 90 top
X2  20.95,55.88 0 top
Y1  72.39,45.72 90 bottom
Y2  48.9,34.04 315 top

### Tracks (layer width: path | path; a pad name or v marks a point on that pad's centre or on a via)
+5V  (via drill 0.35)
  Top 0.254: 51.65,38.52 54.66,41.53 55.79,41.53 57.12,42.86 57.12,42.9 U3.18 | U3.18 | 51.65,38.52 50.8,39.37 50.23,39.37 | 74.61,41.59 76.59,43.57 v76.59,49.53 76.59,59.11 75.62,60.08 50.64,60.08 49.24,58.67 v48.26,58.67 | C18.1 60.82,42.05 59.59,43.28 57.54,43.28 U3.18 | U3.4 50.23,39.37 | 50.23,39.37 | 51.65,38.52 U3.6 | U3.6 | U3.18
  Top 0.406: C18.1 62.7,41.53 L1.1 72.39,41.53 | 72.39,41.53 74.55,41.53 74.61,41.59 +5V.TP | R51.2 72.39,37.34 72.39,41.53
  Bottom 0.254: v48.26,58.67 R44.2 R42.2 R34.2 | D14.C 76.13,49.98 v76.59,49.53
ALERT  (via drill 0.35)
  Top 0.254: R6.2 25.02,47.24 v23.5,45.72 | v23.5,38.1 23.6,38.2 U1.20
  Bottom 0.254: v23.5,45.72 v23.5,38.1 23.5,36.83 26.04,34.29 30.42,34.29 36.23,40.1 37.1,40.1 U2.2
BATT+  (via drill 0.35, 0.6)
  Top 0.254: R15.2 v13.34,46.61 13.28,46.67 D1.A
  Top 0.406: U5.5 v70.48,31.75
  Top 0.813: X1.4 12.06,41.91 R15.2 12.83,43.69 | C24.+ 60.77,28.57 v69.85,28.57 76.2,22.23 76.2,10.16 J2.+
  Bottom 0.254: v13.34,46.61 R11.1 16.89,48.26 R29.2 25.78,45.8 26.5,45.09 27.79,45.09 Q6.2 | X1.4 6.35,48.9 7.24,49.78 R10.2
  Bottom 0.406: v70.48,31.75 69.85,31.11 v69.85,28.57
  Bottom 0.813: X1.4 3.81,41.91 2.54,40.64 v2.54,11.43
  other vias: 22.73,6.3 22.73,10.87 22.73,9.35 22.73,7.82 22.73,4.78 22.73,3.23 22.73,1.7 17.65,6.3 17.65,10.87 17.65,9.35 17.65,7.82 17.65,4.78 17.65,3.23 17.65,1.7 20.19,6.3 20.19,10.87 20.19,9.35 20.19,7.82 20.19,4.78 20.19,3.23 20.19,1.7 58.29,6.3 58.29,10.87 58.29,9.35 58.29,7.82 58.29,4.78 58.29,3.23 58.29,1.7 53.21,6.3 53.21,10.87 53.21,9.35 53.21,7.82 53.21,4.78 53.21,3.23 53.21,1.7 55.75,6.3 55.75,10.87 55.75,9.35 55.75,7.82 55.75,4.78 55.75,3.23 55.75,1.7
  pour Top (isolate 0.61, no thermals): 0,2.54 arc90 2.54,0 74.93,0 arc90 77.47,2.54 77.47,11.94 0,11.94
  pour Bottom (isolate 0.61, no thermals): 0,2.54 arc90 2.54,0 74.93,0 arc90 77.47,2.54 77.47,11.94 0,11.94
  pour Top: 56.9,27.99 56.9,31.11 66.8,31.11 66.67,30.99 66.67,27.99
BATT-  (via drill 0.35, 0.6)
  Top 0.254: R18.2 18.58,27.94 22.23,27.94 24.77,30.48 R3.1
  other vias: 5.71,24.77 5.71,23.88 6.6,23.37 7.62,23.37 8.64,23.37 9.53,23.88 9.53,24.77 14.27,19.18 12.75,19.18 14.27,14.1 12.75,14.1
  pour Top (isolate 0.61, no thermals): 0,25.4 0,13.21 15.49,13.21 15.49,25.4
  pour Bottom (isolate 0.61, no thermals): 0,25.4 0,13.21 15.49,13.21 15.49,25.4
BOOT  (via drill 0.35)
  Top 0.254: v52.7,50.29 52.7,43.81 49.53,40.64 48.11,40.64 U3.1
  Bottom 0.254: R49.2 9.78,55.88 8.3,55.88 Q13.1 7.3,58.74 8.26,59.69 50.8,59.69 52.7,57.78 v52.7,50.29
CHG
  Top 0.254: U1.2 32.55,39.36 Q3.2
DSG
  Top 0.254: R1.2 33.02,30.23 33.02,33.02 31.75,34.29 31.75,36.2 U1.1
  Top 0.508: Q1.1 25.65,21.84 27.94,24.13 27.94,26.67 30.23,28.96 R1.2
DSG-CHG  (via drill 0.6)
  Top 0.813: R25.2 37.47,27.3 40.11,24.66 v40.44,24.66
  other vias: 40.44,22.89 40.44,21.11 40.44,19.33 40.44,17.55 40.44,15.77 40.44,14
  pour Top (isolate 0.61, no thermals): 29.34,13.21 29.34,25.4 51.44,25.4 51.44,13.21
  pour Bottom (isolate 0.61, no thermals): 29.34,13.21 29.34,25.4 51.44,25.4 51.44,13.21
GND  (via drill 0.35)
  other vias: 5.71,28.57 5.71,29.46 6.6,29.97 7.62,29.97 8.64,29.97 9.53,29.46 9.53,28.57 58.17,35.43 59.05,35.43 59.94,35.43 60.83,35.43 60.83,39.12 61.72,39.12 62.61,39.12 63.5,39.12 34.92,42.55 60.33,45.09 51.69,39.75
  pour Top (isolate 0.26, rank 6): 0,27.94 0,58.42 arc-90 2.54,60.96 74.93,60.96 arc-90 77.47,58.42 77.47,27.94
  pour Bottom (isolate 0.26, rank 6): 0,27.94 0,58.42 arc-90 2.54,60.96 74.93,60.96 arc-90 77.47,58.42 77.47,27.94
N$1
  Top 0.254: R3.2 24.27,34.41 C3.2 | C2.1 C3.2 | C3.2 22.23,37.86 22.23,39.43 22.8,40.01 U1.18
N$2
  Top 0.254: R2.2 28.56,34.41 C1.1 C2.2 27.32,37.45 25.41,39.36 U1.19
N$4  (via drill 0.35)
  Top 0.254: U1.9 U1.10 29.95,44.56 30.73,45.34 30.73,47.12 C6.2 31.11,48.9 v30.48,49.53
  Bottom 0.254: R9.2 30.23,49.78 v30.48,49.53
N$5
  Top 0.254: U1.7 32.06,42.61 C4.1
N$6  (via drill 0.35)
  Top 0.254: J6.4 68.41,50.14 66.42,50.14 66.07,49.78 66.07,49.28 66.67,48.67 v66.67,48.26
  Bottom 0.254: v66.67,48.26 U4.6
N$7  (via drill 0.35)
  Top 0.254: v65.41,48.26 65.66,48.52 65.66,49.95 66.82,51.1 J6.3
  Bottom 0.254: v65.41,48.26 U4.5
N$9  (via drill 0.35)
  Top 0.254: U1.6 27.89,41.96 27.3,42.55 27.3,45.72 28.83,47.24 R8.1 28.83,48.23 v26.67,50.39
  Bottom 0.254: R7.2 16.26,52.58 C25.1 19.7,50.39 v26.67,50.39
N$10  (via drill 0.35)
  Top 0.254: v15.24,48.26 15.88,48.9 D1.C
  Bottom 0.254: R10.1 R9.1 11.05,48.26 v15.24,48.26
N$11  (via drill 0.35)
  Top 0.254: S1.4 6.99,56.86 v10.79,56.86 S1.3 13.09,55.49 19.05,49.53 25.4,49.53 27.05,47.88 R8.2
  Bottom 0.254: v10.79,56.86 9.22,56.86 Q13.2
N$12
  Bottom 0.813: Q10.2 18.1,30.68 D13.A 17.14,30.48 16.26,31.37 R14.1 9.27,31.37 X1.1
N$13  (via drill 0.35)
  Top 0.254: U1.12 21.75,43.91 v21.46,44.2
  Bottom 0.254: C7.1 R11.2 15.75,44.32 21.34,44.32 v21.46,44.2
N$14  (via drill 0.35)
  Top 0.813: v17.14,45.09 19.05,43.18 R15.1
  Bottom 0.813: Q8.3 18.59,45.09 17.47,45.09 17.46,45.09 v17.14,45.09
N$16  (via drill 0.35)
  Top 0.254: v22.23,40.64 23.58,40.64 U1.17
  Bottom 0.254: C10.1 R14.2 19.31,29.59 D13.C 20.2,31.82 Q10.1 22.23,34.24 v22.23,40.64
  Bottom 0.813: R14.2 15.4,29.59
N$18  (via drill 0.35)
  Top 0.813: X1.3 12.06,39.37 R16.2 16.51,41.27 v16.51,42.55
  Bottom 0.813: v16.51,42.55 17.41,43.45 Q8.2 | D11.A 17.14,41.91 v16.51,42.55 | v16.51,42.55 16.26,42.55 R12.1
N$19  (via drill 0.35)
  Top 0.813: v16.51,38.73 16.82,38.43 16.91,38.43 17.24,38.1 R16.1
  Bottom 0.813: Q9.3 17.61,39.84 v16.51,38.73
N$20  (via drill 0.35)
  Top 0.254: Q2.1 54.36,16.76 52.7,18.41 52.7,29.27 D2.C 51.44,30.54 v51.44,32.38
  Bottom 0.254: R20.1 41.66,37.08 43.18,35.56 45.34,35.56 R21.2 50.55,32.38 v51.44,32.38
N$21  (via drill 0.35)
  Top 0.254: U1.13 U1.14 U1.15 23.58,41.94 v22.23,41.94
  Bottom 0.254: C8.1 R12.2 16.38,40.89 19.18,40.89 D11.C 20,42.11 Q8.1 20.71,43.45 v22.23,41.94
N$22  (via drill 0.35)
  Top 0.813: v16.51,33.02 R17.1 19.05,33.66
  Bottom 0.813: Q10.3 17.61,34.12 v16.51,33.02
N$23
  Bottom 0.254: C15.1 44.28,41.18 U2.27
N$24
  Bottom 0.254: C11.1 C12.2
N$26  (via drill 0.35)
  Top 0.254: v42.55,34.29 43.81,33.02 45.72,33.02 47.56,31.18 D2.A
  Bottom 0.254: v42.55,34.29 41.66,34.29 R20.2 R22.1
N$27  (via drill 0.35)
  Top 0.254: X1.2 3.17,36.83 1.27,38.73 1.27,50.16 3.46,52.36 S1.2 6.35,52.36 | S1.1 6.35,52.36 | v6.35,54.61 6.35,52.36
  Top 0.813: X1.2 9.53,36.83 R17.2 16.51,36.2 v16.51,37.47
  Bottom 0.254: Q13.3 6.62,54.88 v6.35,54.61
  Bottom 0.813: 16.63,37.47 17.83,37.47 Q9.2 | D12.A 16.63,37.47 | 16.63,37.47 v16.51,37.47 16.26,37.47 R13.1
N$28  (via drill 0.35)
  Top 0.254: Q3.3 35.39,37 v35.56,36.83
  Bottom 0.254: v35.56,36.83 37.21,36.83 R22.2
N$29
  Bottom 0.254: C13.2 C14.1
N$30
  Bottom 0.254: Q4.1 46.02,31.37 R23.2 44.45,33.27 R24.1
N$31
  Bottom 0.254: R24.2 44.7,36.2 D5.C
N$32
  Bottom 0.254: D5.A 51.49,34.87 52.2,34.16 Q5.3
N$33
  Bottom 0.254: Q5.1 56.07,33.21 56.52,33.66 56.52,36.83 55.5,37.85 R26.1
N$34  (via drill 0.35 pad 0.85)
  Top 0.813: R25.1 41.91,32.38 v41.91,33.02
  Bottom 0.813: v41.91,33.02 43.18,31.75 Q4.3
N$35
  Bottom 0.254: U2.12 35.7,45.18 | 35.7,45.18 Q7.1 | R27.1 35.7,47.23 35.7,45.18
N$36
  Bottom 0.254: Q7.3 32,46.47 R28.1
N$37
  Bottom 0.254: Q6.1 26.99,47.69 R29.1 R28.2
N$38
  Bottom 0.254: R30.2 Q6.3
N$39
  Bottom 0.254: R31.2 27.94,38.73 | 27.94,38.73 R30.1 | 32.14,38.73 27.94,38.73 | U2.7 36.09,42.68 C16.1 32.14,38.73 | 32.14,38.73 32.16,38.73
N$40
  Bottom 0.254: R32.1 45.58,42.79 45.57,42.79 45.47,42.68 U2.24
N$41  (via drill 0.35)
  Top 0.254: v53.34,49.53 D6.- | v48.9,49.53 45.72,49.53 v45.09,48.9
  Bottom 0.254: U2.16 42.87,46.68 v45.09,48.9 | v53.34,49.53 v48.9,49.53
N$42  (via drill 0.35)
  Top 0.254: v46.35,48.9 49.53,48.9 50.16,49.53 D7.-
  Bottom 0.254: U2.17 42.91,46.26 43.78,46.26 46.41,48.9 v46.35,48.9
N$43  (via drill 0.35)
  Top 0.254: v43.81,48.9 46.99,52.07 D8.-
  Bottom 0.254: U2.18 42.74,45.76 41.87,45.76 41.68,45.95 41.68,48.26 42.32,48.9 v43.81,48.9
N$44  (via drill 0.35)
  Top 0.254: v41.27,48.9 43.81,51.44 D9.-
  Bottom 0.254: U2.19 41.81,45.18 41.27,45.72 v41.27,48.9
N$45  (via drill 0.35)
  Top 0.254: v40.64,49.53 D10.-
  Bottom 0.254: U2.20 41.05,44.68 40.64,45.09 v40.64,49.53
N$46
  Top 0.254: R35.2 D6.+
N$47
  Top 0.254: D7.+ R36.2
N$48  (via drill 0.35)
  Top 0.254: v48.9,47.62 v38.1,47.62 | S2.3 v59.05,56.86 S2.4 55.59,56.86 54.61,55.88 54.61,48.9 v53.98,48.26
  Bottom 0.254: v38.1,47.62 38.1,47.14 38.33,46.91 38.33,46.35 38.15,46.18 U2.14 | v59.05,56.86 59.09,56.9 R33.1 | v53.98,48.26 53.34,47.62 v48.9,47.62
N$49
  Top 0.254: D8.+ R37.2
N$50
  Top 0.254: D9.+ R38.2
N$51
  Top 0.254: D10.+ R39.2
N$55
  Bottom 0.254: U4.13 63.44,40.96 63.44,40.93 63.28,40.77 58.05,40.77 C22.1
N$56  (via drill 0.35)
  Top 0.254: S3.4 S3.3 | v37.85,55.37 37.85,56.85 S3.3 | S3.3 37.85,59.45 38.1,59.69 48.92,59.69 v49.53,60.3 | v56.52,46.35 v55.24,47.63 | U3.29 50.23,43.18 v50.8,43.18
  Bottom 0.254: R34.1 40.39,55.37 v37.85,55.37 | v49.53,60.3 51.46,60.3 54.64,57.12 55.5,57.12 55.85,56.77 55.85,48.24 v55.24,47.63 52.94,45.33 52.94,45.32 v50.8,43.18 | C22.2 56.49,46.33 v56.52,46.35
N$58
  Bottom 0.254: U4.7 68.64,46.56 68.64,46.53 70.65,44.52 Y1.1
N$59
  Bottom 0.254: Y1.3 69.55,46.92 U4.8
N$60
  Bottom 0.254: U4.3 62.17,47.94 62.17,47.97 60.61,49.53 R45.1
N$61
  Top 0.254: Y2.3 | Y2.3 50.8,34.24 50.8,35.41 U3.8 | U3.8
N$62
  Top 0.254: Y2.1 49.1,35.94 | 49.1,35.94 | 49.1,35.94 50.2,35.94 U3.7
N$63
  Bottom 0.254: U4.2 60.9,47.94 60.9,47.97 60.61,48.26 60.07,48.26 59.69,48.64 59.69,50.17 59.06,50.8 57.53,50.8 56.77,50.04 R46.1
N$64  (via drill 0.35)
  Top 0.254: v49.35,41.83 48.29,42.9 U3.31
  Bottom 0.254: R45.2 55.63,46.35 54.6,46.35 53.58,45.33 53.58,45.32 51.44,43.18 51.44,42.55 50.72,41.83 v49.35,41.83
N$65  (via drill 0.35)
  Top 0.254: v49.78,42.55 48.87,43.46 U3.30
  Bottom 0.254: R46.2 54.58,49.12 54.58,48.01 49.78,43.21 v49.78,42.55
N$66  (via drill 0.35)
  Top 0.254: U3.20 | U3.20 56.02,43.96 v55.24,43.18
  Bottom 0.254: C23.2 54.57,42.55 v55.24,43.18
N$67  (via drill 0.35)
  Top 0.254: v21.04,41.19 21.16,41.31 U1.16
  Bottom 0.254: C9.1 R13.2 16.64,34.67 17.14,35.18 19.18,35.18 D12.C 20.2,37.53 Q9.1 21.04,38.77 v21.04,41.19
N$68
  Top 0.254: U5.4 72.33,30.8 72.9,31.37 R50.2 R51.1
N$70
  Top 0.254: C19.1 70.25,33.14 69.83,32.72 68.59,32.72 U5.6
N$71  (via drill 0.35)
  Top 0.254: v59.05,41.91 59.05,38.73 55.88,35.56 54.46,35.56 U3.9
  Bottom 0.254: R52.2 63.5,46.35 v59.05,41.91
N$72  (via drill 0.35)
  Top 0.254: D17.+ v63.5,50.9
  Bottom 0.254: v63.5,50.9 R52.1
PACK-  (via drill 0.6)
  Bottom 0.254: C14.2 42.17,28.57 | 42.17,28.57 42.23,28.63 Q4.2 | 42.17,28.57 45.34,28.57 R23.1 R21.1 52.7,26.42 52.7,24.77 53.21,24.26 v55.19,24.26
  other vias: 56.72,24.26 62.81,24.26 61.29,24.26 59.77,24.26 58.24,24.26 56.72,19.46 62.81,19.46 61.29,19.46 59.77,19.46 58.24,19.46 55.19,19.46 56.72,14.3 59.77,14.3 58.24,14.3 55.19,14.3 62.81,21.87 61.29,21.87
  pour Top (isolate 0.61, no thermals): 77.47,25.4 54.1,25.4 54.1,13.21 77.47,13.21
  pour Bottom (isolate 0.61, no thermals): 77.47,25.4 54.1,25.4 54.1,13.21 77.47,13.21
PRECHG
  Bottom 0.254: U2.5 37.27,41.6 38.14,41.6 41.64,38.1 R26.2
REGOUT  (via drill 0.35)
  Top 0.254: U1.8 30.29,43.26 C5.1 33.64,46.61 R4.2 | R4.2 R5.2 40.39,46.61 41.27,45.72 41.27,43.18 40.51,42.42 v40.51,41.66 | R4.2 36.58,49.8 | v54.86,58.04 R35.1 R36.1 48.26,58.04 | 48.26,58.04 R37.1 R38.1 R39.1 | 48.26,58.04 v48.26,57.15 | 36.58,49.91 36.58,49.8 | 36.58,49.8 v36.59,49.78
  Bottom 0.254: R43.2 48.58,50.86 Q11.1 48.26,55.3 v48.26,57.15 47.62,57.15 46.99,57.78 45.08,57.78 44.74,57.45 44.74,56.35 44.77,56.32 Q12.1 44.77,50.86 R41.2 37.47,50.8 36.45,49.78 | C17.1 45.86,41.68 U2.26 42.8,41.66 v40.51,41.66 | C17.1 47.36,43.18 48.26,43.18 48.9,43.81 48.9,45.09 48.01,45.97 R32.2 | 36.45,49.78 R27.2 34.92,51.44 REGOUT.TP | Q5.2 53.61,36.43 54.53,37.35 54.53,38.85 52.74,40.64 46.99,40.64 46.09,41.54 C17.1 | v36.59,49.78 36.45,49.78 | R33.2 60.33,58.04 v54.86,58.04
RSNS-DSG  (via drill 0.6)
  Top 0.254: R18.1 17.78,24.86 17.78,26.04 19.05,27.3 23.24,27.3 R2.1 29.46,30.73 R1.1
  Bottom 0.254: C13.1 26.87,26.67 v24.46,24.26
  other vias: 19.89,14.1 21.41,14.1 18.36,14.1 26.24,16.64 18.36,16.64 19.89,16.64 18.36,19.18 19.89,19.18 18.36,15.37 19.89,15.37 18.36,17.91 19.89,17.91 18.36,20.45 19.89,20.45 21.41,19.18 22.94,19.18 24.46,19.18 22.94,14.1 24.46,14.1 22.94,24.26
  pour Top (isolate 0.61, no thermals): 17.53,25.4 26.8,25.4 26.8,13.21 17.53,13.21
  pour Bottom (isolate 0.61, no thermals): 17.53,25.4 26.8,25.4 26.8,13.21 17.53,13.21
SCL  (via drill 0.35)
  Top 0.254: U1.5 35.53,41.31 | 35.53,41.31 v35.56,41.27 | R5.1 35.84,41.31 35.53,41.31
  Bottom 0.254: v35.56,41.27 35.66,41.18 U2.4
SDA  (via drill 0.35)
  Top 0.254: U1.4 35.37,40.66 v35.56,40.47 37.93,40.47 40.64,43.18 40.64,45.09 40.35,45.38 40.11,45.62 37.36,45.62 R4.1
  Bottom 0.254: v35.56,40.47 35.76,40.67 35.81,40.67 35.82,40.68 U2.3
SMBC  (via drill 0.35)
  Top 0.254: v38.73,48.26 50.8,48.26 51.44,48.9 v51.44,50.8 | v38.73,48.26 38.76,48.29 | v38.73,48.26 37.47,49.53 37.47,50.16 36.83,50.8 27.94,50.8 26.04,52.7 24.13,52.7 22.23,54.61 X2.3
  Bottom 0.254: Q11.2 50.48,50.86 R43.1 v51.44,50.8 | U2.13 38.7,45.68 38.73,45.72 v38.73,48.26
SMBC_MCU  (via drill 0.35)
  Top 0.254: v52.07,51.3 52.07,48.92 50.98,47.83 50.37,47.83 49.15,46.61 49.15,45.4 U3.28 | U3.28
  Bottom 0.254: Q11.3 R44.1 51.05,56.9 52.07,55.88 v52.07,51.3
SMBD  (via drill 0.35)
  Top 0.254: v39.37,49.53 37.52,51.38 28.54,51.38 27.3,52.62 27.3,57.15 26.04,58.42 20.32,58.42 19.68,57.78 X2.2
  Bottom 0.254: Q12.2 46.67,50.86 R41.1 46.36,50.8 45.38,49.82 41.21,49.82 40.89,50.14 39.98,50.14 v39.37,49.53 39.37,45.72 38.33,44.68 U2.11
SMBD_MCU  (via drill 0.35)
  Top 0.254: U3.27 50.15,45.53 v50.15,46.37
  Bottom 0.254: Q12.3 R42.1 46.61,56.9 47.62,55.88 47.62,47.62 48.88,46.37 v50.15,46.37
SW  (via drill 0.35)
  Top 0.61: U5.2 v64.64,31.75 v63.75,31.75
  other vias: 65.96,35.56 68.63,35.56 66.85,35.56 67.74,35.56
  pour Bottom: 70.23,35.81 63.25,35.81 63.25,31.37 65.15,31.37 65.15,34.67 70.23,34.67
  pour Top: 62.87,38.23 62.87,34.54 71.75,34.54 71.75,38.23
USB+  (via drill 0.35)
  Top 0.254: v71.75,50.8 71.12,50.8 69.83,49.51 J6.5 66.7,49.51 v66.67,49.53
  Bottom 0.254: D14.A 72.21,50.8 v71.75,50.8 | U4.16 61.02,42.34 61.02,42.37 64.77,46.12 64.77,48.9 65.41,49.53 v66.67,49.53 | C21.1 66.67,53.98
  Bottom 0.305: C20.A 66.67,56.9 66.67,53.98 v66.67,49.53
(copper drawn outside any net)
  shapes: Top area x2

### Text on the board
tNames: BQ769200 | TPS562200 | BATTERY / MANAGEMENT / SYSTEM V1.1
bNames: BQ78350-R1